# Altium schematic sheet DAC_BLE.SchDoc
size A4; Organization: Altium Limited; Address1: L3, 12a Rodborough Rd; Address2: Frenchs Forest; Address3: NSW; Address4: Australia 2086
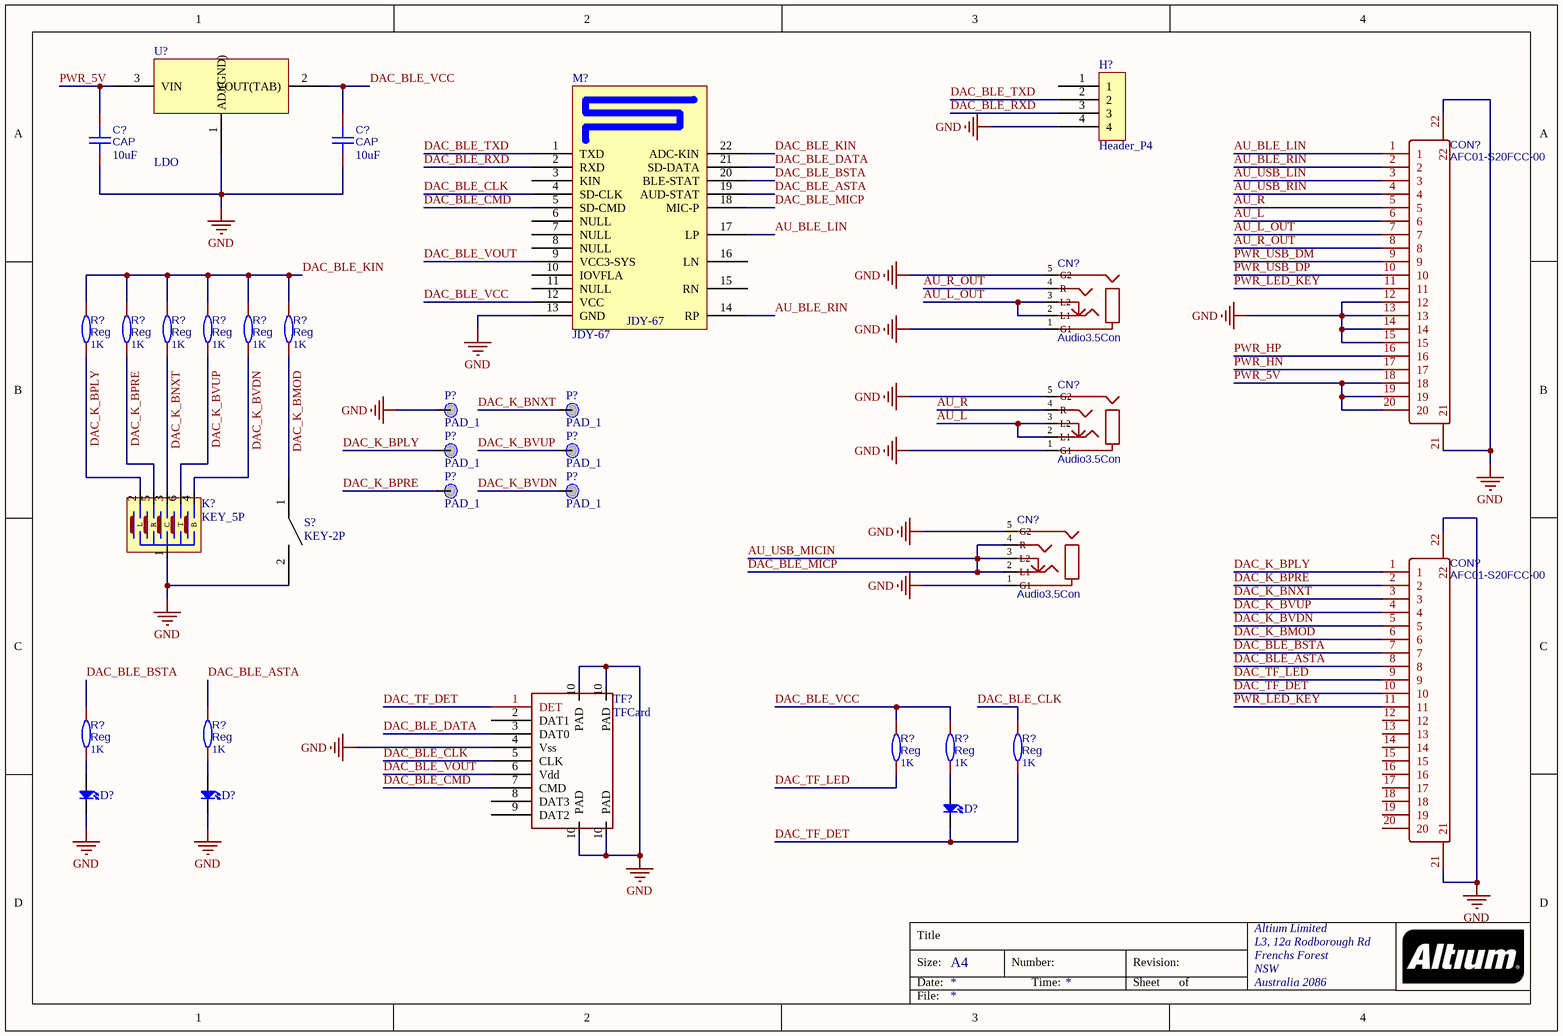
[diagram p0: DAC_BLE.SchDoc]

## Parts
(Parts that share a designator on the sheet are numbered #1, #2 ... from top to bottom, then left to right.)
C?#1  CAP  value 10uF  [C0603]
C?#2  CAP  value 10uF  [C0603]
CN?#1  Audio3.5Con  [Audio3.5_3Pin]
CN?#2  Audio3.5Con  [Audio3.5_3Pin]
CN?#3  Audio3.5Con  [Audio3.5_3Pin]
CON?#1  AFC01-S20FCC-00  [FPC-SMD_20P_0.5]
CON?#2  AFC01-S20FCC-00  [FPC-SMD_20P_0.5]
D?#1  LED  [LED0603]  (value not drawn)
D?#2  LED  [LED0603]  (value not drawn)
D?#3  LED  [LED0603]  (value not drawn)
H?  Header_P4  [H_1.27_P4]
K?  KEY_5P  [KEY_5]
M?  JDY-67  [JDY-67]
P?#1  PAD_1
P?#2  PAD_1
P?#3  PAD_1
P?#4  PAD_1
P?#5  PAD_1
P?#6  PAD_1
R?#1  Reg  value 1K  [R0603]
R?#2  Reg  value 1K  [R0603]
R?#3  Reg  value 1K  [R0603]
R?#4  Reg  value 1K  [R0603]
R?#5  Reg  value 1K  [R0603]
R?#6  Reg  value 1K  [R0603]
R?#7  Reg  value 1K  [R0603]
R?#8  Reg  value 1K  [R0603]
R?#9  Reg  value 1K  [R0603]
R?#10  Reg  value 1K  [R0603]
R?#11  Reg  value 1K  [R0603]
S?  KEY-2P  [KEY_SOT_P2]
TF?  TFCard
U?  LDO  [SOT-89]

## Nets
GND: C?#1.2 C?#2.2 CN?#1.1(G1) CN?#1.5(G2) CN?#2.1(G1) CN?#2.5(G2) CN?#3.1(G1) CN?#3.5(G2) CON?#1.12 CON?#1.13 CON?#1.14 CON?#1.15 CON?#1.21 CON?#1.22 CON?#2.21 CON?#2.22 D?#1.1(K) D?#2.1(K) H?.4 K?.1(G) M?.13(GND) P?#1.1 S?.2 TF?.4(Vss) TF?.10(PAD) U?.1(ADJ(GND))
AU_BLE_LIN: CON?#1.1 M?.17(LP)
AU_BLE_RIN: CON?#1.2 M?.14(RP)
AU_L: CN?#2.2(L1) CN?#2.3(L2) CON?#1.6
AU_L_OUT: CN?#1.2(L1) CN?#1.3(L2) CON?#1.7
AU_R: CN?#2.4(R) CON?#1.5
AU_R_OUT: CN?#1.4(R) CON?#1.8
AU_USB_LIN: CON?#1.3
AU_USB_MICIN: CN?#3.2(L1) CN?#3.3(L2) CN?#3.4(R) M?.18(MIC-P)  [also labelled DAC_BLE_MICP]
AU_USB_RIN: CON?#1.4
DAC_BLE_ASTA: CON?#2.8 M?.19(AUD-STAT) R?#8.2
DAC_BLE_BSTA: CON?#2.7 M?.20(BLE-STAT) R?#7.2
DAC_BLE_CLK: M?.4(SD-CLK) R?#11.2 TF?.5(CLK)
DAC_BLE_CMD: M?.5(SD-CMD) TF?.7(CMD)
DAC_BLE_DATA: M?.21(SD-DATA) TF?.3(DAT0)
DAC_BLE_KIN: M?.22(ADC-KIN) R?#1.2 R?#2.2 R?#3.2 R?#4.2 R?#5.2 R?#6.2
DAC_BLE_RXD: H?.3 M?.2(RXD)
DAC_BLE_TXD: H?.2 M?.1(TXD)
DAC_BLE_VCC: C?#2.1 M?.12(VCC) R?#9.2 R?#10.2 U?.2(VOUT(TAB))
DAC_BLE_VOUT: M?.9(VCC3-SYS) TF?.6(Vdd)
DAC_K_BMOD: CON?#2.6 R?#6.1 S?.1
DAC_K_BNXT: CON?#2.3 K?.3(C) P?#2.1 R?#3.1
DAC_K_BPLY: CON?#2.1 K?.2(L) P?#3.1 R?#1.1
DAC_K_BPRE: CON?#2.2 K?.5(R) P?#5.1 R?#2.1
DAC_K_BVDN: CON?#2.5 K?.4(B) P?#6.1 R?#5.1
DAC_K_BVUP: CON?#2.4 K?.6(T) P?#4.1 R?#4.1
DAC_TF_DET: CON?#2.10 D?#3.1(K) R?#11.1 TF?.1(DET)
DAC_TF_LED: CON?#2.9 R?#9.1
PWR_5V: C?#1.1 CON?#1.18 CON?#1.19 CON?#1.20 U?.3(VIN)
PWR_HN: CON?#1.17
PWR_HP: CON?#1.16
PWR_LED_KEY: CON?#1.11 CON?#2.11
PWR_USB_DM: CON?#1.9
PWR_USB_DP: CON?#1.10
NetD?#1_2: D?#1.2(A) R?#7.1
NetD?#2_2: D?#2.2(A) R?#8.1
NetD?#3_2: D?#3.2(A) R?#10.1

Not connected (* = marked no-connect by the designer): CON?#2 12 13 14 15 16 17 18 19 20; H? 1; M? 3(KIN) 6(NULL) 7(NULL) 8(NULL) 10(IOVFLA) 11(NULL) 15(RN) 16(LN); TF? 2(DAT1) 8(DAT3) 9(DAT2)

## Notes on the sheet
- Title
- Size:
- Date:
- A4
- Number:
- Time:
- Revision:
- Sheet
- of
- File:

## Library data of the parts
C?#1 C?#2 = CAP: BOM_Manufacturer: Huaxin S&T; BOM_Manufacturer Part: 0603B103K101CT; nameAlias: Capacitance; Contributor: LCSC; BOM_Supplier: LCSC; BOM_Supplier Part: C302008; spicePre: C; spiceSymbolName: 0603B103K101CT
CN?#1-CN?#3 = AudioCon3: 3.5mm 3Pin 音频接口; BOM_Manufacturer: G-Switch(品赞); BOM_Manufacturer Part: PJ-393; Contributor: LCSC; BOM_Supplier: LCSC; BOM_Supplier Part: C2837065; BOM_JLCPCB Part Class: Extended Part; spicePre: C; spiceSymbolName: PJ-393_C2837065
CON?#1 CON?#2 = FPC_CONN_20: FPC连接器20Pin; BOM_Manufacturer: JUSHUO; Contributor: LCSC; BOM_Supplier: LCSC; BOM_Supplier Part: C262274; BOM_Manufacturer Part: AFC01-S20FCC-00; BOM_JLCPCB Part Class: Extended Part; spicePre: F; spiceSymbolName: AFC01-S20FCC-00
D?#1-D?#3 = LED0: Published: 8-Jun-2000; LatestRevisionDate: 08-Jul-2005; LatestRevisionNote: Mech Layer 1 removed.; PackageReference: LED-0; Publisher: Altium Limited; PackageDescription: LED; 2 Leads
H? = Header_P4: 4Pin排针
K? = KEY_5P: 五向开关
P?#1-P?#6 = PAD_1: 1脚焊盘
R?#1-R?#11 = Res: 电阻; BOM_Manufacturer: Viking Tech; BOM_Manufacturer Part: AR03BTCX1002A; nameAlias: Resistance (Ohms); Contributor: LCSC; BOM_Supplier: LCSC; BOM_Supplier Part: C465721; spicePre: R; spiceSymbolName: AR03BTCX1002A
S? = KEY_2P: KEY-2Pp
TF? = TFCard: TF卡座
U? = AMS1117